# EAGLE design lixie_digit_dots (EAGLE 7.6.0)
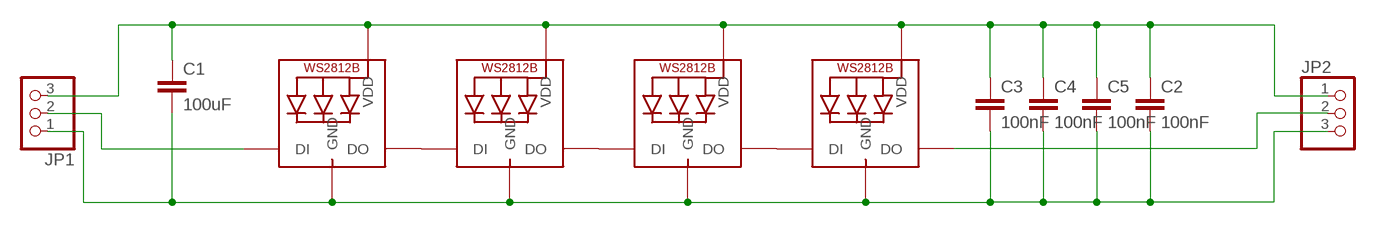
[diagram p0: schematic, sheet 1]

## Parts
C1  100uF  C-EUC1206K  [C1206K]
C2  100nF  C-EUC0402K  [C0402K]
C3  100nF  C-EUC0402K  [C0402K]
C4  100nF  C-EUC0402K  [C0402K]
C5  100nF  C-EUC0402K  [C0402K]
JP1  PINHD-1X3  [1X03]
JP2  PINHD-1X3  [1X03]
LED1  WS2812B5050  [WS2812B]
LED2  WS2812B5050  [WS2812B]
LED3  WS2812B5050  [WS2812B]
LED4  WS2812B5050  [WS2812B]

## Nets
GND: C1.2 C2.2 C3.2 C4.2 C5.2 JP1.1 JP2.3 LED1.3-GND(GND) LED2.3-GND(GND) LED3.3-GND(GND) LED4.3-GND(GND)
N$1: LED1.2-DOUT(DO) LED2.4-DIN(DI)
N$2: LED2.2-DOUT(DO) LED3.4-DIN(DI)
N$3: LED3.2-DOUT(DO) LED4.4-DIN(DI)
N$23: JP1.2 LED1.4-DIN(DI)
N$24: JP2.2 LED4.2-DOUT(DO)
VCC: C1.1 C2.1 C3.1 C4.1 C5.1 JP1.3 JP2.1 LED1.1-VDD(VDD) LED2.1-VDD(VDD) LED3.1-VDD(VDD) LED4.1-VDD(VDD)

## Library data of the parts
C1-C5 = rcl:C-EU: CAPACITOR, European symbol
JP1 JP2 = adafruit:PINHD-1X3: PIN HEADER
LED1-LED4 = adafruit:WS2812B

## Board
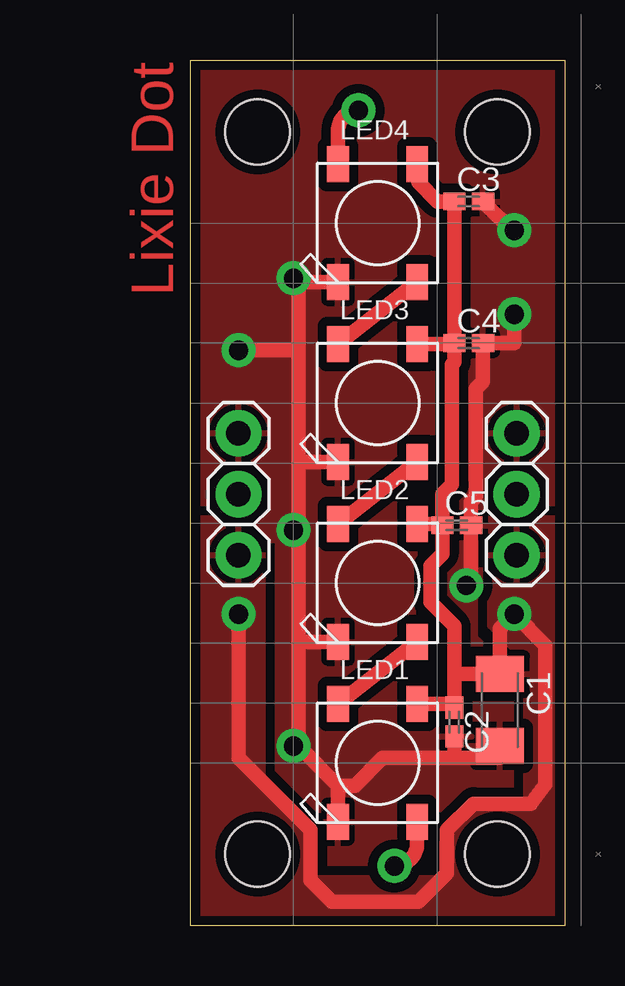
[diagram p1: board, top side]
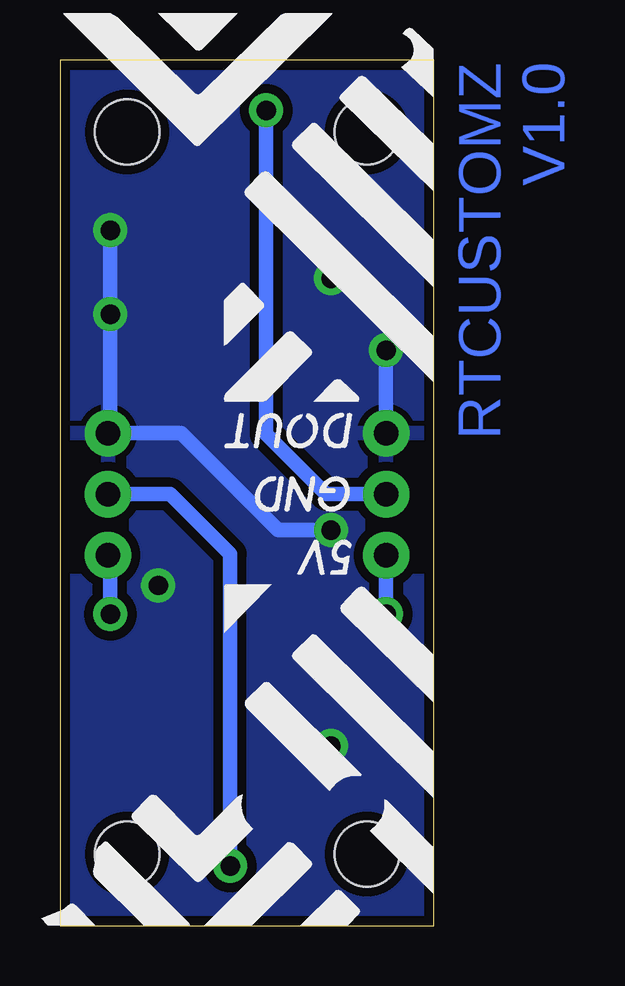
[diagram p2: board, bottom side, seen from below]

Size 15.6 x 36.1 mm. Coordinates in mm from the lower left corner, seen from the top.
Outline: 0,0 0,36.1 15.6,36.1 15.6,0 0,0
Copper layers (1*16): Top 0.035mm / dielectric 1.6mm / Bottom 0.035mm
Design rules "Elecrow_2-layer_PCB_eagle_rule *": minimum track width 6mil, minimum drill 12mil, track to track 15mil, track to pad 15mil, pad to pad 15mil, via to via 15mil, smd to smd 0mil, copper to edge 16mil, drill to drill 10mil, minimum pad ring 6mil, minimum via ring 6mil, stop-mask expansion 0mil, vias tented up to drill 100mil, thermal gap 10mil
Holes 2.7 mm at 2.8,33.1 12.8,33.1 12.8,3 2.8,3

### Footprints (pad centres in the part's own frame; a part is rotated, then mirrored left to right if it is on the bottom)
C1206K = smd 1.5 x 2: 1 -1.5,0; 2 1.5,0
C0402K = smd 0.925 x 0.74: 1 -0.6,0; 2 0.6,0
1X03 = drill 1.016 pad 1.93: 1 -2.54,0; 2 0,0; 3 2.54,0
WS2812B = smd 1.5 x 0.9: 1-VDD 2.45,-1.65; 2-DOUT 2.45,1.65; 3-GND -2.45,1.65; 4-DIN -2.45,-1.65

### Placement (x,y rotation side)
C1  12.9,9 270 top
C2  11,8.5 270 top
C3  11.6,30.2 0 top
C4  11.6,24.3 0 top
C5  11.1,16.7 0 top
JP1  13.6,18 270 top
JP2  2,18 90 top
LED1  7.8,6.8 90 top
LED2  7.8,14.3 90 top
LED3  7.8,21.8 90 top
LED4  7.8,29.3 90 top

### Tracks (layer width: path | path; a pad name or v marks a point on that pad's centre or on a via)
GND  (via drill 0.8 pad 1.42)
  Top 0.61: 4.5,11.85 4.5,7.5 6.15,5.85 | 4.5,11.85 4.5,16.5 | 4.5,16.5 4.5,19.35 | 4.5,19.35 4.5,24 | 4.5,24 4.5,26.85 LED4.3-GND | LED2.3-GND 4.5,11.85 | LED3.3-GND 4.5,19.35 | v2,24 4.5,24 | v13.5,25.5 13.5,24.3 C4.2 12.2,22.7 11.9,22.4 11.9,17.9 11.7,17.7 C5.2 11.7,14.4 v11.5,14.2 | C2.2 11,7 | LED1.3-GND 6.15,5.85 | C3.2 13.5,28.9 v13.5,29 | 6.15,5.85 6.85,5.85 8,7 11,7 | v4.3,16.5 4.5,16.5 | 11,7 12.9,7 C1.2
  Bottom 0.61: JP2.3 v2,24 | v13.5,29 v13.5,25.5 13.5,20.64 JP1.1 10.54,20.54 6.5,16.5 v4.3,16.5
  other vias: 4.3,7.5 4.3,27
  pour Top (rank 2): 16,-0.5 -0.5,-0.5 -0.5,36.5 16,36.5
  pour Bottom: -0.5,36 16,36 16,-1 -0.5,-1
N$1
  Top 0.61: LED2.4-DIN LED1.2-DOUT
N$2
  Top 0.61: LED3.4-DIN LED2.2-DOUT
N$3
  Top 0.61: LED4.4-DIN LED3.2-DOUT
N$23  (via drill 0.8 pad 1.42)
  Top 0.61: LED1.4-DIN 9.45,3.45 arc-90 v8.5,2.5
  Bottom 0.61: v8.5,2.5 8.5,15.5 11,18 JP1.2
N$24  (via drill 0.8 pad 1.42)
  Top 0.61: LED4.2-DOUT 6.15,33.15 arc-90 v7,34
  Bottom 0.61: v7,34 7,20.5 4.5,18 JP2.2
VCC  (via drill 0.8 pad 1.42)
  Top 0.61: LED1.1-VDD 11,9.25 | C4.1 C3.1 10.3,30.2 9.5,31 9.5,31.7 LED4.1-VDD | LED3.1-VDD 11,24.25 C4.1 | C5.1 10.45,16.75 LED2.1-VDD | C5.1 10.5,18 10.9,18.4 10.9,23.4 11,23.5 C4.1 | 11,9.25 11,10.5 | 11,10.5 11,12.5 10,13.5 10,15 10.5,15.5 C5.1 | C2.1 11,9.25 | v2,13 2,7 5,4 5,1.9 5.9,1 9.5,1 10.7,2.2 10.7,4 11.8,5.1 14.2,5.1 14.8,5.9 14.8,11.7 v13.5,13 12.9,12.4 C1.1 11,10.5
  Bottom 0.61: JP1.3 13.5,15.46 v13.5,13 | JP2.1 v2,13
  pour Top: 0,17 3,17 3,6 5,4 5,2 10.5,2 10.5,3.5 12,5 14,5 14,11 12.5,12.5 12.5,17 15.5,17 15.5,0 0,0

### Text on the board
Top: Lixie Dot
Bottom: RTCUSTOMZ / V1.0
tNames: REV.2 | Lixie WS2812B Display
tDocu: Lixie Display PCB | Revision 2 | Layout by Connor Nishijima | Last Updated: / December 16th, 2016 | Released under the GPLv3 License | [OSHW] US000054